# Altium project VoltageRegulatorShield_update.PrjPcb
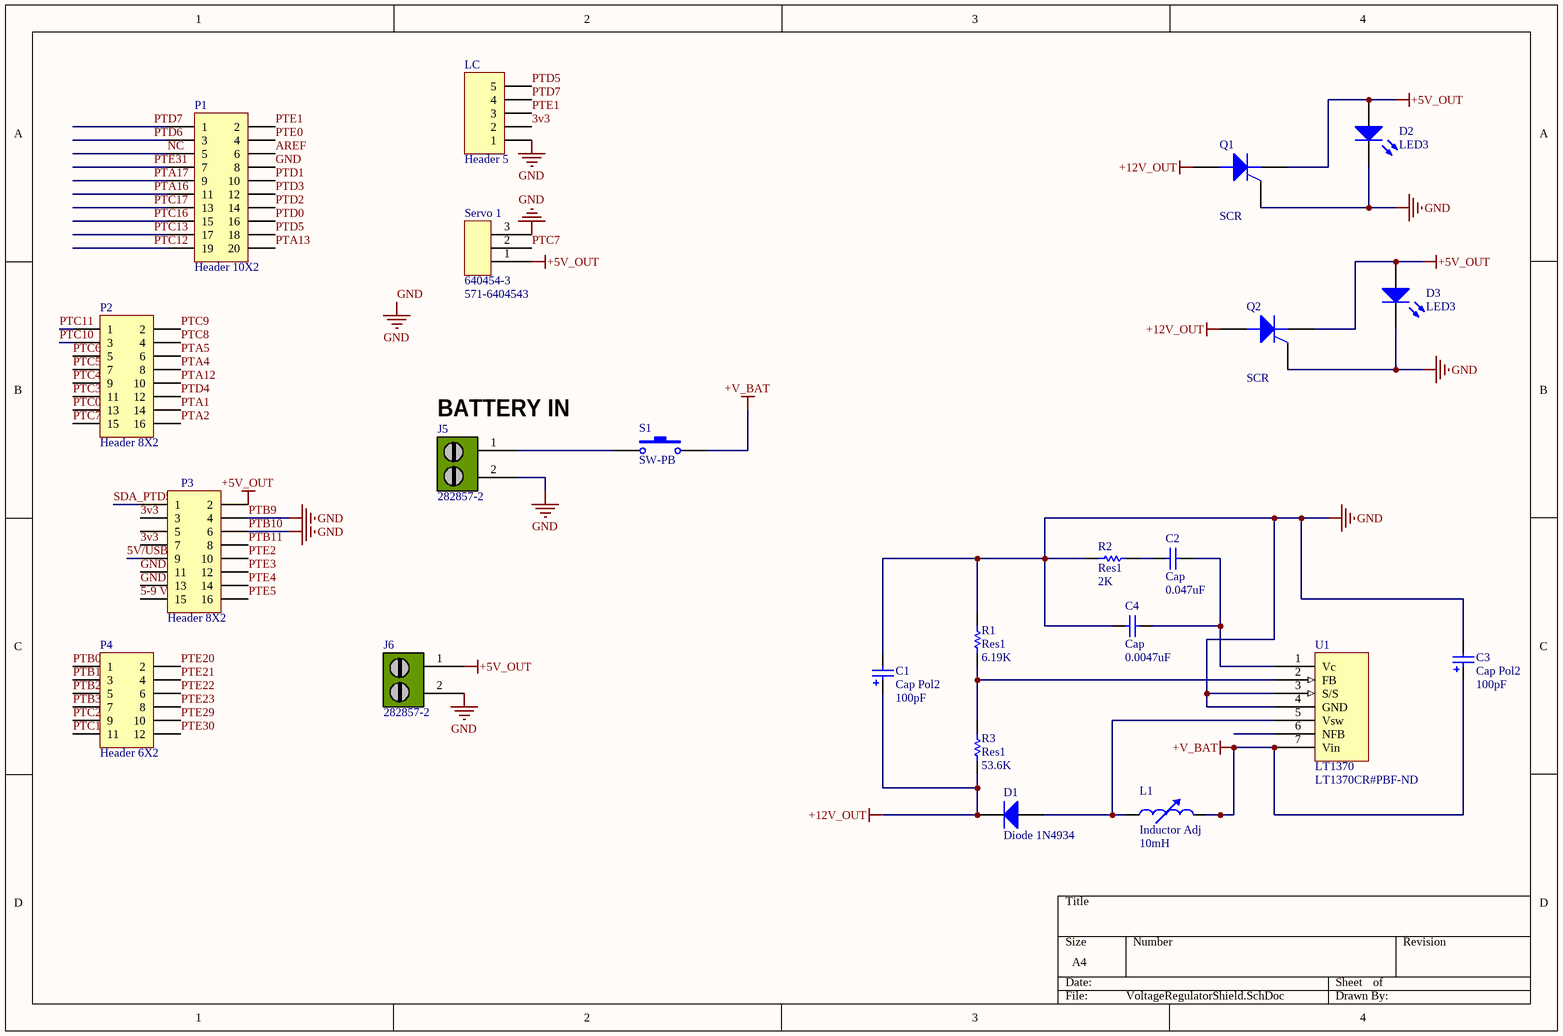
[diagram p0: VoltageRegulatorShield.SchDoc]
1 sheet, 23 parts. Net scope: global (net labels, ports and power ports of the same name join across sheets).
Board file: VoltageRegulatorShield_update.PcbDoc

## Sheet VoltageRegulatorShield.SchDoc
size A4

### Parts
C1  Cap Pol2  value 100pF  [POLAR0.8]
C2  Cap  value 0.047uF  [RAD-0.3]
C3  Cap Pol2  value 100pF  [POLAR0.8]
C4  Cap  value 0.0047uF  [RAD-0.3]
D1  Diode 1N4934  [DO-41]
D2  LED3  [3.5X2.8X1.9]
D3  LED3  [3.5X2.8X1.9]
J5  282857-2  [282857-2]
J6  282857-2  [282857-2]
L1  Inductor Adj  value 10mH  [AXIAL-0.8]
LC  Header 5  [HDR1X5]
P1  Header 10X2  [HDR2X10]
P2  Header 8X2  [HDR2X8]
P3  Header 8X2  [HDR2X8]
P4  Header 6X2  [HDR2X6]
Q1  SCR  [TO-220-AB]
Q2  SCR  [TO-220-AB]
R1  Res1  value 6.19K  [AXIAL-0.3]
R2  Res1  value 2K  [AXIAL-0.3]
R3  Res1  value 53.6K  [AXIAL-0.3]
S1  SW-PB  [SPST-2]
Servo_1  640454-3  Supplier Part Number 1: 571-6404543  [6404543]
U1  LT1370  Supplier Part Number 1: LT1370CR#PBF-ND  [DDPak7]

### Nets
+5V_OUT: D2.1(A) D3.1(A) J6.1 P3.2 Q1.3(K) Q2.3(K) Servo_1.1
+12V_OUT: C1.1 D1.2(K) Q1.1(A) Q2.1(A) R3.2
+V_BAT: C3.1 L1.2 S1.2 U1.7(Vin)
GND: C1.2 C3.2 C4.1 D2.2(K) D3.2(K) J5.2 J6.2 LC.1 P1.8 P3.4 P3.6 P3.11 P3.13 Q1.2(G) Q2.2(G) R1.1 R2.1 Servo_1.3 U1.3(S/S) U1.4(GND)  [also labelled PTB10, PTB9]
3v3: LC.2 P3.3 P3.7
5-9 Vin: P3.15
5V/USB: P3.9
AREF: P1.6
NC: P1.5
PTA1: P2.14
PTA2: P2.16
PTA4: P2.8
PTA5: P2.6
PTA12: P2.10
PTA13: P1.20
PTA16: P1.11
PTA17: P1.9
PTB0: P4.1
PTB1: P4.3
PTB2: P4.5
PTB3: P4.7
PTB11: P3.8
PTC0: P2.13
PTC1: P4.11
PTC2: P4.9
PTC3: P2.11
PTC4: P2.9
PTC5: P2.7
PTC6: P2.5
PTC7: P2.15 Servo_1.2
PTC8: P2.4
PTC9: P2.2
PTC10: P2.3
PTC11: P2.1
PTC12: P1.19
PTC13: P1.17
PTC16: P1.15
PTC17: P1.13
PTD0: P1.16
PTD1: P1.10
PTD2: P1.14
PTD3: P1.12
PTD4: P2.12
PTD5: LC.5 P1.18
PTD6: P1.3
PTD7: LC.4 P1.1
PTE0: P1.4
PTE1: LC.3 P1.2
PTE2: P3.10
PTE3: P3.12
PTE4: P3.14
PTE5: P3.16
PTE20: P4.2
PTE21: P4.4
PTE22: P4.6
PTE23: P4.8
PTE29: P4.10
PTE30: P4.12
PTE31: P1.7
SDA_PTD5: P3.1
NetC2_1: C2.1 R2.2
NetC2_2: C2.2 C4.2 U1.1(Vc)
NetD1_1: D1.1(A) L1.1 U1.5(Vsw)
NetJ5_1: J5.1 S1.1
NetR1_2: R1.2 R3.1 U1.2(FB)

Not connected (* = marked no-connect by the designer): P3 5; U1 6(NFB)

### Notes on the sheet
- (near J5) BATTERY IN

### Library data of the parts
C1 C3 = Cap Pol2: Polarized Capacitor (Axial); Published: 8-Jun-2000; LatestRevisionDate: 17-Jul-2002; LatestRevisionNote: Re-released for DXP Platform.; PackageReference: POLAR0.8; Publisher: Altium Limited; PackageDescription: Polarized Capacitor; 2 Leads
C2 C4 = Cap: Capacitor; Published: 8-Jun-2000; LatestRevisionDate: 17-Jul-2002; LatestRevisionNote: Re-released for DXP Platform.; PackageReference: RAD-0.3; Publisher: Altium Limited; PackageDescription: Radial Cap, Thru-Hole; 2 Leads; 0.3 in Pin Spacing
D1 = Diode 1N4934: 1 Amp Fast Recovery Rectifier; Published: 8-Jun-2000; LatestRevisionDate: 17-Jul-2002; LatestRevisionNote: Re-released for DXP Platform.; DatasheetVersion: 1999; PackageVersion: Aug-1999; PackageReference: DO-41; Publisher: Altium Limited; PackageDescription: Diode, Axial; Body 5.2 x 2.7 mm (LxDia. max), Lead Dia. 0.86 mm (max); Code_JEDEC: DO-204-AL; ComponentLink1Description: Manufacturer Link; ComponentLink1URL: http://www.fairchildsemi.com/; ComponentLink2Description: Datasheet; ComponentLink2URL: http://www.fairchildsemi.com/ds/1N%2F1N4934.pdf
D2 D3 = LED3: Typical BLUE SiC LED; Published: 8-Jun-2000; LatestRevisionDate: 17-Dec-2003; LatestRevisionNote: PCB Footprint replaced.; DatasheetVersion: 16-Apr-2002; PackageVersion: 16-Apr-2002; PackageReference: 3.5X2.8X1.9; Publisher: Altium Limited; PackageDescription: SM LED; 2 C-Bend Leads; Body 3.5 x 2.8 x 1.9 mm, inc leads (LxWxH typ)
J5 J6 = 282857-2: TERM BLOCK 2POS SIDE ENT 5.08MM; Manufacturer: TE Connectivity; Number of Levels: 1; Positions Per Level: 2; Pitch: 0.200" (5.08mm); Mating Orientation: Horizontal with Board; Current: 24A; Voltage: 300V; Wire Gauge: 12-30 AWG; Wire Termination: Screw - Rising Cage Clamp; Clamp Material - Plating: Brass - Nickel Plated; Torque - Screw: 0.79 Nm (7.0 Lb-In); Screw Thread: M3; Supplier 1: Digi-Key; Supplier Part Number 1: A98359-ND; Manufacturer Part Number: 282857-2; RoHS: RoHS Compliant; Category: Connectors, Interconnects; Stock 1: 1811; Pricing 1: 1=1.19, 10=1.046, 25=0.984, 50=0.9432, 100=0.9021, 250=0.82012, 500=0.7381, 1000=0.65608, 2500=0.59457 (USD); Mounting Type: Through Hole; Features: Interlocking (Side); Color: Green; Packaging: Bulk; Operating Temperature: -; Housing Material: Polyamide (PA66), Nylon 6/6; Contact Material - Plating: Brass - Tin Plated; Screw Material - Plating: Brass - Nickel Plated; ComponentLink1URL: http://documents.tycoelectronics.com/commerce/DocumentDelivery/DDEController?Action=srchrtrv&DocNm=282857&DocType=CD&DocLang=EN; ComponentLink1Description: http://documents.tycoelectronics.com/commerce/DocumentDelivery/DDEController?Action=srchrtrv&DocNm=282857&DocType=CD&DocLang=EN; Value: 282857-2
L1 = Inductor Adj: Adjustable Inductor; Set Position: 0.5; Published: 24-Mar-1999; LatestRevisionDate: 17-Jul-2002; LatestRevisionNote: Re-released for DXP Platform.; PackageReference: AXIAL-0.8; Publisher: Altium Limited; PackageDescription: Axial Device, Thru-Hole; 2 Leads; 0.8 in Pin Spacing
LC = Header 5: Header, 5-Pin; LatestRevisionDate: 17-Jul-2002; LatestRevisionNote: Re-released for DXP Platform.; Publisher: Altium Limited
P1 = Header 10X2: Header, 10-Pin, Dual row; LatestRevisionDate: 17-Jul-2002; LatestRevisionNote: Re-released for DXP Platform.; Publisher: Altium Limited
P2 P3 = Header 8X2: Header, 8-Pin, Dual row; LatestRevisionDate: 17-Jul-2002; LatestRevisionNote: Re-released for DXP Platform.; Publisher: Altium Limited
P4 = Header 6X2: Header, 6-Pin, Dual row; LatestRevisionDate: 17-Jul-2002; LatestRevisionNote: Re-released for DXP Platform.; Publisher: Altium Limited
Q1 Q2 = SCR: Silicon Controlled Rectifier; Published: 8-Jun-2000; LatestRevisionDate: 17-Jul-2002; LatestRevisionNote: Re-released for DXP Platform.; PackageReference: TO-220-AB; Publisher: Altium Limited; Code_JEDEC: TO-220-AB
R1-R3 = Res1: Resistor; Published: 8-Jun-2000; LatestRevisionDate: 17-Jul-2002; LatestRevisionNote: Re-released for DXP Platform.; PackageReference: AXIAL-0.3; Publisher: Altium Limited; PackageDescription: Axial Device, Thru-Hole; 2 Leads; 0.3 in Pin Spacing
S1 = SW-PB: Switch; Published: 24-Mar-1999; LatestRevisionDate: 17-Jul-2002; LatestRevisionNote: Re-released for DXP Platform.; PackageReference: SPST-2; Publisher: Altium Limited; PackageDescription: Switch; 2 Leads
Servo_1 = 640454-3: Headers & Wire Housings POLARIZED HEADER 3P Straight Post tin; Supplier 1: Mouser
U1 = LT1370: Supplier 1: Digi-Key